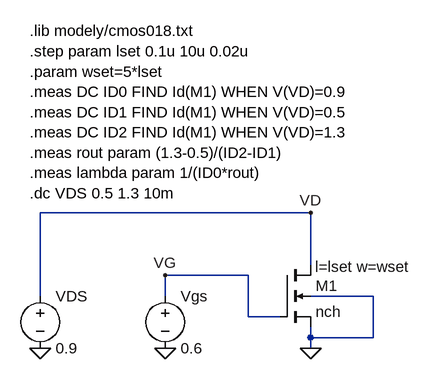
[diagram p0: schematic N1-mos.asc]
N1-mos.asc, the LTspice schematic file:
Version 4
SHEET 1 880 680
WIRE 224 64 -192 64
WIRE 224 144 224 64
WIRE 128 160 0 160
WIRE -192 192 -192 64
WIRE 0 192 0 160
WIRE 320 192 224 192
WIRE 128 224 128 160
WIRE 176 224 128 224
WIRE 224 256 224 240
WIRE 320 256 320 192
WIRE 320 256 224 256
WIRE 224 272 224 256
FLAG 224 272 0
FLAG -192 272 0
FLAG 0 272 0
FLAG 224 64 VD
FLAG 0 160 VG
SYMBOL nmos4 176 144 R0
WINDOW 123 55 3 Left 2
SYMATTR Value2 l=lset w=wset
SYMATTR InstName M1
SYMATTR Value nch
SYMBOL voltage 0 176 R0
WINDOW 123 0 0 Left 0
WINDOW 39 0 0 Left 0
SYMATTR InstName Vgs
SYMATTR Value 0.6
SYMBOL voltage -192 176 R0
WINDOW 123 0 0 Left 0
WINDOW 39 0 0 Left 0
SYMATTR InstName VDS
SYMATTR Value 0.9
TEXT -208 -216 Left 2 !.lib modely/cmos018.txt\n.step param lset 0.1u 10u 0.02u\n.param wset=5*lset\n.meas DC ID0 FIND Id(M1) WHEN V(VD)=0.9\n.meas DC ID1 FIND Id(M1) WHEN V(VD)=0.5\n.meas DC ID2 FIND Id(M1) WHEN V(VD)=1.3\n.meas rout param (1.3-0.5)/(ID2-ID1)\n.meas lambda param 1/(ID0*rout)\n.dc VDS 0.5 1.3 10m

The netlist it stands for:
* N1-mos.asc
M1 VD VG 0 0 nch l=lset w=wset
Vgs VG 0 0.6
VDS VD 0 0.9
.model NMOS NMOS
.model PMOS PMOS
.lib standard.mos
.lib modely/cmos018.txt
.step param lset 0.1u 10u 0.02u
.param wset=5*lset
.meas DC ID0 FIND Id(M1) WHEN V(VD)=0.9
.meas DC ID1 FIND Id(M1) WHEN V(VD)=0.5
.meas DC ID2 FIND Id(M1) WHEN V(VD)=1.3
.meas rout param (1.3-0.5)/(ID2-ID1)
.meas lambda param 1/(ID0*rout)
.dc VDS 0.5 1.3 10m
.backanno
.end

* Results of the author's LTspice run, read from the files saved beside the schematic
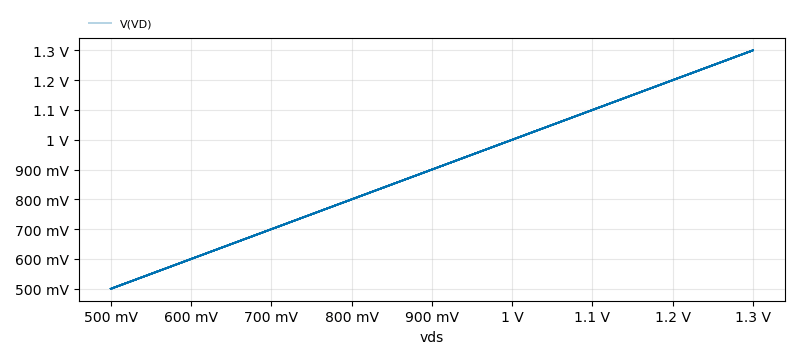
[diagram p1: DC transfer characteristic of N1-mos.asc, plotted from the saved traces]
* DC transfer characteristic, 496 runs:
*   V(VD) [run 1]: 500 mV at vds=500 mV, 1.3 V at vds=1.3 V, min 500 mV, max 1.3 V
*   V(VD) [run 2]: 500 mV at vds=500 mV, 1.3 V at vds=1.3 V, min 500 mV, max 1.3 V
*   V(VD) [run 3]: 500 mV at vds=500 mV, 1.3 V at vds=1.3 V, min 500 mV, max 1.3 V
*   V(VD) [run 4]: 500 mV at vds=500 mV, 1.3 V at vds=1.3 V, min 500 mV, max 1.3 V
*   V(VD) [run 5]: 500 mV at vds=500 mV, 1.3 V at vds=1.3 V, min 500 mV, max 1.3 V
*   V(VD) [run 6]: 500 mV at vds=500 mV, 1.3 V at vds=1.3 V, min 500 mV, max 1.3 V
*   V(VD) [run 7]: 500 mV at vds=500 mV, 1.3 V at vds=1.3 V, min 500 mV, max 1.3 V
*   V(VD) [run 8]: 500 mV at vds=500 mV, 1.3 V at vds=1.3 V, min 500 mV, max 1.3 V
* From the log:
*   Measurement: id0
*     step  id(m1)  at
*        1  3.1864e-05  0.9
*        2  2.53619e-05  0.9
*        3  2.07958e-05  0.9
*        4  1.76602e-05  0.9
*        5  1.55351e-05  0.9
*        6  1.41146e-05  0.9
*        7  1.31868e-05  0.9
*        8  1.26072e-05  0.9
*        9  1.2277e-05  0.9
*       10  1.21277e-05  0.9
*       11  1.21111e-05  0.9
*       12  1.21923e-05  0.9
*       13  1.23459e-05  0.9
*       14  1.25529e-05  0.9
*       15  1.27988e-05  0.9
*       16  1.30728e-05  0.9
*       17  1.33664e-05  0.9
*       18  1.3673e-05  0.9
*       19  1.39876e-05  0.9
*       20  1.43062e-05  0.9
*       21  1.46257e-05  0.9
*       22  1.49438e-05  0.9
*       23  1.52587e-05  0.9
*       24  1.55688e-05  0.9
*       25  1.58732e-05  0.9
*       26  1.61711e-05  0.9
*       27  1.64618e-05  0.9
*       28  1.67449e-05  0.9
*       29  1.70203e-05  0.9
*       30  1.72877e-05  0.9
*       31  1.7547e-05  0.9
*       32  1.77983e-05  0.9
*       33  1.80417e-05  0.9
*       34  1.82772e-05  0.9
*       35  1.8505e-05  0.9
*       36  1.87252e-05  0.9
*       37  1.89381e-05  0.9
*       38  1.91438e-05  0.9
*       39  1.93425e-05  0.9
*       40  1.95346e-05  0.9
*     ...
*   Measurement: id1
*     step  id(m1)  at
*        1  2.39846e-05  0.5
*        2  2.00203e-05  0.5
*        3  1.69988e-05  0.5
*        4  1.48384e-05  0.5
*        5  1.33485e-05  0.5
*        6  1.23536e-05  0.5
*        7  1.17184e-05  0.5
*        8  1.13445e-05  0.5
*        9  1.11616e-05  0.5
*       10  1.11194e-05  0.5
*       11  1.11815e-05  0.5
*       12  1.1321e-05  0.5
*       13  1.15181e-05  0.5
*       14  1.17577e-05  0.5
*       15  1.20282e-05  0.5
*       16  1.23206e-05  0.5
*       17  1.26282e-05  0.5
*       18  1.29455e-05  0.5
*       19  1.32684e-05  0.5
*       20  1.35934e-05  0.5
*       21  1.39181e-05  0.5
*       22  1.42403e-05  0.5
*       23  1.45587e-05  0.5
*       24  1.48719e-05  0.5
*       25  1.5179e-05  0.5
*       26  1.54795e-05  0.5
*       27  1.57726e-05  0.5
*       28  1.60583e-05  0.5
*       29  1.63361e-05  0.5
*       30  1.66061e-05  0.5
*       31  1.6868e-05  0.5
*       32  1.71221e-05  0.5
*       33  1.73683e-05  0.5
*       34  1.76067e-05  0.5
*       35  1.78375e-05  0.5
*       36  1.80609e-05  0.5
*       37  1.82769e-05  0.5
*       38  1.8486e-05  0.5
*       39  1.86881e-05  0.5
*       40  1.88837e-05  0.5
*     ...
*   Measurement: id2
*     step  id(m1)  at
*        1  4.031e-05  1.3
*        2  3.10069e-05  1.3
*        3  2.47712e-05  1.3
*        4  2.05915e-05  1.3
*        5  1.77896e-05  1.3
*        6  1.59166e-05  1.3
*        7  1.46779e-05  1.3
*        8  1.38797e-05  1.3
*        9  1.33929e-05  1.3
*       10  1.31296e-05  1.3
*       11  1.30291e-05  1.3
*       12  1.3048e-05  1.3
*       13  1.31549e-05  1.3
*       14  1.33267e-05  1.3
*       15  1.35461e-05  1.3
*       16  1.37999e-05  1.3
*       17  1.40781e-05  1.3
*       18  1.43729e-05  1.3
*       19  1.46783e-05  1.3
*       20  1.49897e-05  1.3
*       21  1.53035e-05  1.3
*       22  1.56169e-05  1.3
*       23  1.59277e-05  1.3
*       24  1.62344e-05  1.3
*       25  1.65357e-05  1.3
*       26  1.68306e-05  1.3
*       27  1.71186e-05  1.3
*       28  1.7399e-05  1.3
*       29  1.76717e-05  1.3
*       30  1.79363e-05  1.3
*       31  1.81929e-05  1.3
*       32  1.84414e-05  1.3
*       33  1.86818e-05  1.3
*       34  1.89143e-05  1.3
*       35  1.9139e-05  1.3
*       36  1.9356e-05  1.3
*       37  1.95657e-05  1.3
*       38  1.9768e-05  1.3
*       39  1.99634e-05  1.3
*       40  2.01519e-05  1.3
*     ...
*   Measurement: rout
*     step  (1.3-0.5)/(id2-id1)
*        1  49003.4
*        2  72816
*        3  102928
*        4  139056
*        5  180136
*        6  224534
*        7  270320
*        8  315559
*        9  358543
*       10  397966
*       11  432993
*       12  463256
*       13  488779
*       14  509871
*       15  527022
*       16  540795
*       17  551767
*       18  560477
*       19  567401
*       20  572946
*       21  577448
*       22  581179
*       23  584357
*       24  587151
*       25  589691
*       26  592080
*       27  594393
*       28  596689
*       29  599009
*       30  601385
*       31  603839
*       32  606386
*       33  609037
*       34  611799
*       35  614676
*       36  617669
*       37  620779
*       38  624004
*       39  627341
*       40  630790
*     ...
*   Measurement: lambda
*     step  1/(id0*rout)
*        1  0.640431
*        2  0.541491
*        3  0.467187
*        4  0.407208
*        5  0.357343
*        6  0.315536
*        7  0.280532
*        8  0.251364
*        9  0.227179
*       10  0.207193
*       11  0.190693
*       12  0.177048
*       13  0.165716
*       14  0.156241
*       15  0.148252
*       16  0.141448
*       17  0.135591
*       18  0.130491
*       19  0.125999
*       20  0.122001
*       21  0.118405
*       22  0.11514
*       23  0.112151
*       24  0.109394
*       25  0.106834
*       26  0.104443
*       27  0.1022
*       28  0.100085
*       29  0.0980843
*       30  0.0961859
*       31  0.0943791
*       32  0.0926555
*       33  0.0910078
*       34  0.0894297
*       35  0.0879154
*       36  0.0864604
*       37  0.0850603
*       38  0.0837115
*       39  0.0824105
*       40  0.0811542
*     ...